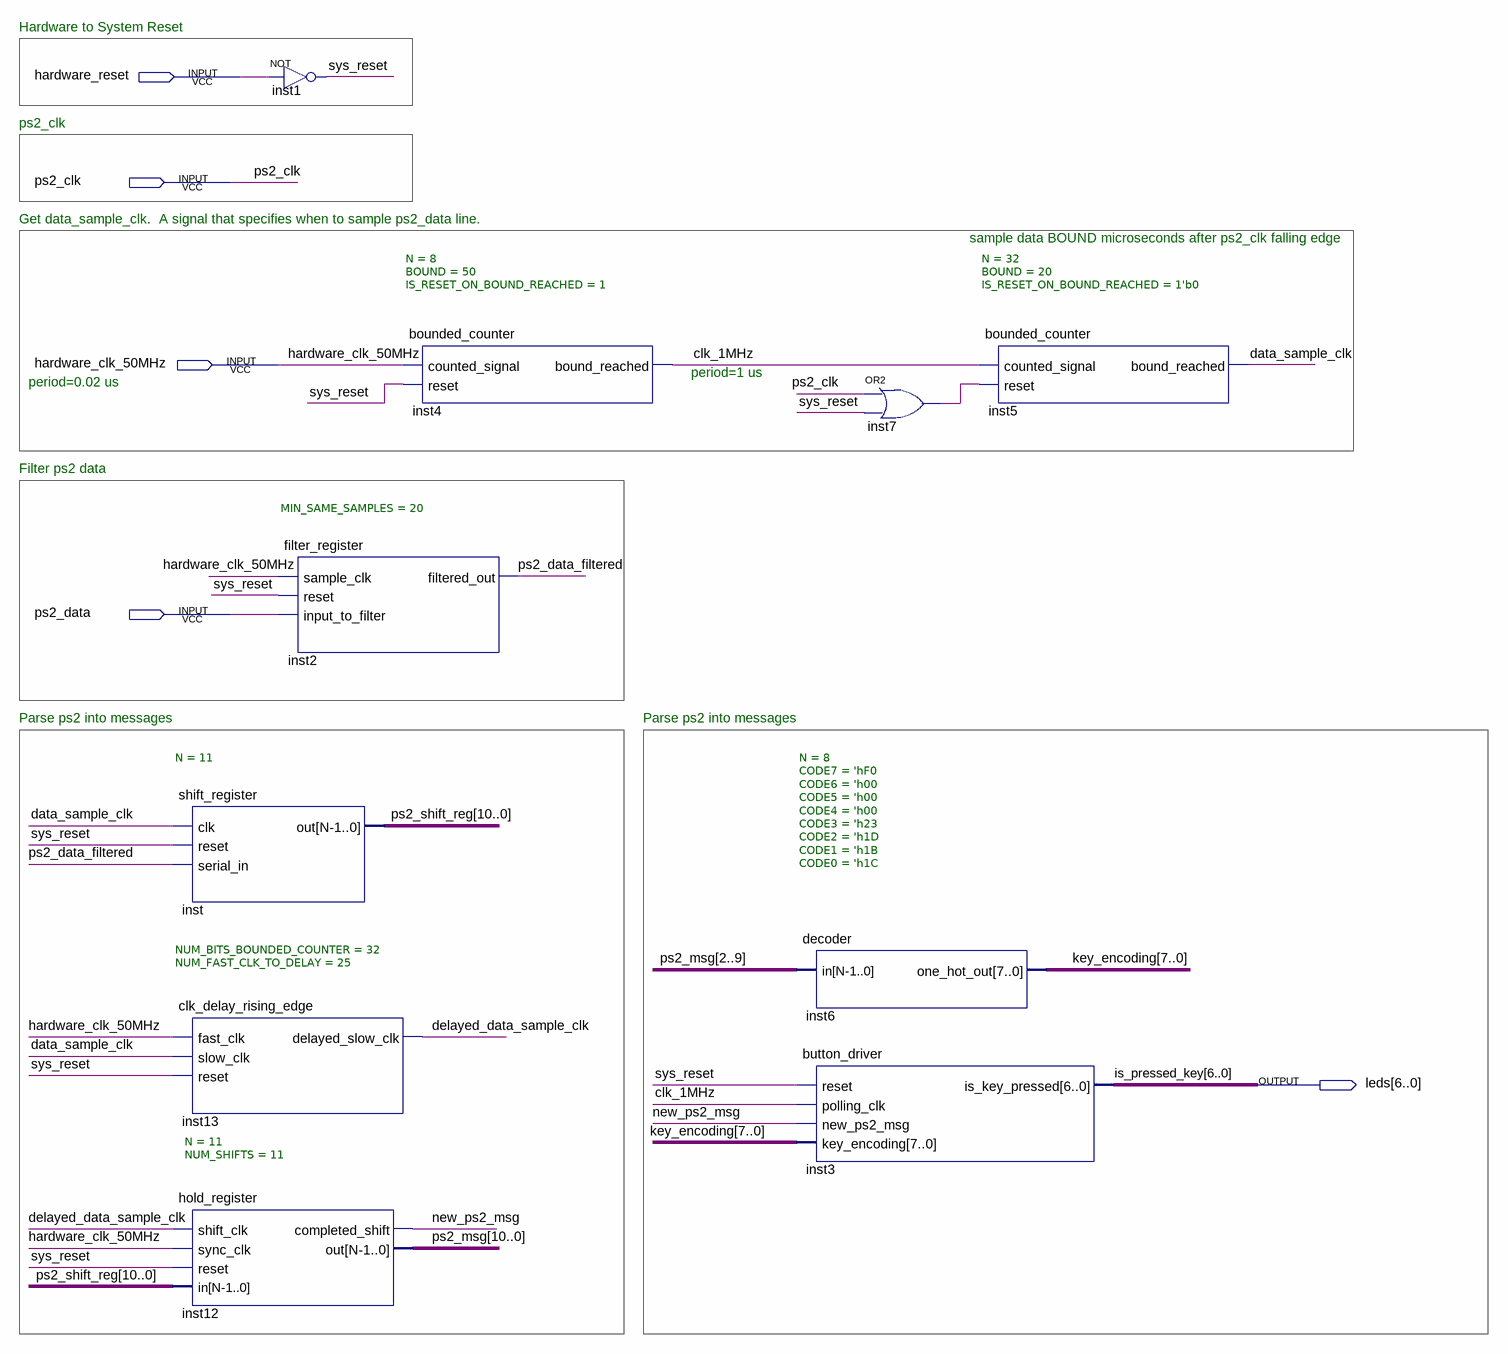
[diagram p0: schematic sheet]
// Quartus schematic ps2_bring_up.bdf as structural Verilog: 10 symbols, 5 pins
module ps2_bring_up (
  input  hardware_reset,
  input  ps2_clk,
  input  hardware_clk_50MHz,
  input  ps2_data,
  output [6:0] leds
);

  wire clk_1MHz, data_sample_clk, delayed_data_sample_clk, inst7_out, new_ps2_msg, ps2_data_filtered,
       sys_reset;
  wire [7:0] key_encoding;
  wire [10:0] ps2_msg, ps2_shift_reg;

  shift_register #(.N(11)) inst (
    .clk(data_sample_clk), .reset(sys_reset), .serial_in(ps2_data_filtered), .out(ps2_shift_reg));
  clk_delay_rising_edge #(.NUM_BITS_BOUNDED_COUNTER(32), .NUM_FAST_CLK_TO_DELAY(25)) inst13 (
    .fast_clk(hardware_clk_50MHz), .slow_clk(data_sample_clk), .reset(sys_reset),
    .delayed_slow_clk(delayed_data_sample_clk));
  hold_register #(.N(11), .NUM_SHIFTS(11)) inst12 (
    .shift_clk(delayed_data_sample_clk), .sync_clk(hardware_clk_50MHz), .reset(sys_reset),
    .in(ps2_shift_reg), .completed_shift(new_ps2_msg), .out(ps2_msg));
  not inst1 (sys_reset, hardware_reset);
  filter_register #(.MIN_SAME_SAMPLES(20)) inst2 (
    .sample_clk(hardware_clk_50MHz), .reset(sys_reset), .input_to_filter(ps2_data),
    .filtered_out(ps2_data_filtered));
  bounded_counter #(.N(8), .BOUND(50), .IS_RESET_ON_BOUND_REACHED(1)) inst4 (
    .counted_signal(hardware_clk_50MHz), .reset(sys_reset), .bound_reached(clk_1MHz));
  or inst7 (inst7_out, ps2_clk, sys_reset);
  decoder #(.N(8), .CODE7('hF0), .CODE6('h00), .CODE5('h00), .CODE4('h00), .CODE3('h23), .CODE2('h1D), .CODE1('h1B), .CODE0('h1C)) inst6 (
    .in({ps2_msg[2], ps2_msg[3], ps2_msg[4], ps2_msg[5], ps2_msg[6], ps2_msg[7], ps2_msg[8], ps2_msg[9]}),
    .one_hot_out(key_encoding));
  button_driver inst3 (
    .reset(sys_reset), .polling_clk(clk_1MHz), .new_ps2_msg(new_ps2_msg), .key_encoding(key_encoding),
    .is_key_pressed(leds));
  bounded_counter #(.N(32), .BOUND(20), .IS_RESET_ON_BOUND_REACHED(1'b0)) inst5 (
    .counted_signal(clk_1MHz), .reset(inst7_out), .bound_reached(data_sample_clk));

  // Other names for the same wires on the sheet: is_pressed_key[6:0] = leds

  // Notes on the sheet:
  //   Hardware to System Reset
  //   ps2_clk
  //   Get data_sample_clk.  A signal that specifies when to sample ps2_data line.
  //   sample data BOUND microseconds after ps2_clk falling edge
  //   period=1 us
  //   period=0.02 us
  //   Filter ps2 data
  //   Parse ps2 into messages
  //   Parse ps2 into messages
endmodule
